# Altium schematic sheet reefpi_pico_smc.SchDoc: reef-pi Pico - System Controller
size A4; DocumentNumber: 4; Revision: A; SheetNumber: 4; SheetTotal: 8
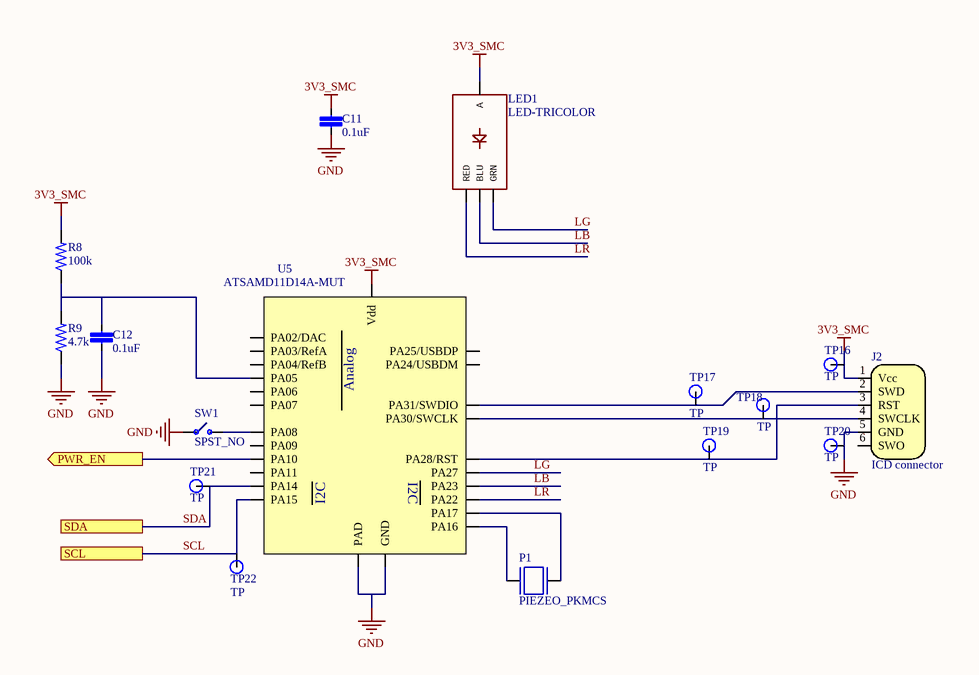
[diagram p0: reefpi_pico_smc.SchDoc]

## Parts
C11  0.1uF  [C0603]
C12  0.1uF  [C0603]
J2  ICD connector  [TC2030-MCP-NL]  (no BOM)
LED1  LED-TRICOLOR  [LED-TRICOLOR-SMD]
P1  PIEZEO_PKMCS  [PIEZO_PKMCS0909E4000]
R8  100k  [R0603]
R9  4.7k  [R0603]
SW1  SPST_NO  [B3U-1000P]
TP16  TP  [TP_0.89mm]
TP17  TP  [TP_0.89mm]
TP18  TP  [TP_0.89mm]
TP19  TP  [TP_0.89mm]
TP20  TP  [TP_0.89mm]
TP21  TP  [TP_0.89mm]
TP22  TP  [TP_0.89mm]
U5  ATSAMD11D14A-MUT  [QFN24-4x4mm-0.5]

## Ports
PWR_EN (out), SCL, SDA

## Nets
3V3_SMC: C11.1 J2.1(Vcc) LED1.A R8.2 TP16.1 U5.24(Vdd)
GND: C11.2 C12.2 J2.5(GND) R9.1 SW1.2 TP20.1 U5.23(GND) U5.PAD
LB: LED1.B(BLU) U5.16(PA23)
LG: LED1.G(GRN) U5.17(PA27)
LR: LED1.R(RED) U5.15(PA22)
PWR_EN: U5.9(PA10) ; port PWR_EN
SCL: TP22.1 U5.12(PA15) ; port SCL
SDA: TP21.1 U5.11(PA14) ; port SDA
NetC12_1: C12.1 R8.1 R9.2 U5.4(PA05)
NetJ2_2: J2.2(SWD) TP17.1 U5.20(PA31/SWDIO)
NetJ2_3: J2.3(RST) TP19.1 U5.18(PA28/RST)
NetJ2_4: J2.4(SWCLK) TP18.1 U5.19(PA30/SWCLK)
NetP1_1: P1.1 U5.14(PA17)
NetP1_2: P1.2 U5.13(PA16)
NetSW1_1: SW1.1 U5.7(PA08)

Not connected (* = marked no-connect by the designer): J2 6(SWO); U5 1(PA02/DAC) 2(PA03/RefA) 3(PA04/RefB) 5(PA06) 6(PA07) 8(PA09) 10(PA11) 21(PA24/USBDM) 22(PA25/USBDP)

## Notes on the sheet
- Title
- Size:
- Date:
- A4
- Number:
- Time:
- Revision:
- Sheet
- of
- github.com/blueacro
- blueacro.com
- CERN OHL v1.2
- Made available under the
- File:
- © 2018 StackFoundry LLC. All Rights Reserved.
- (in symbol ATSAMD11D14A-MUT) Analog; I2C

## Library data of the parts
C11 C12 = C-EU
J2 = TC2030-SWD-NL: Conector par ICD
R8 R9 = R-US